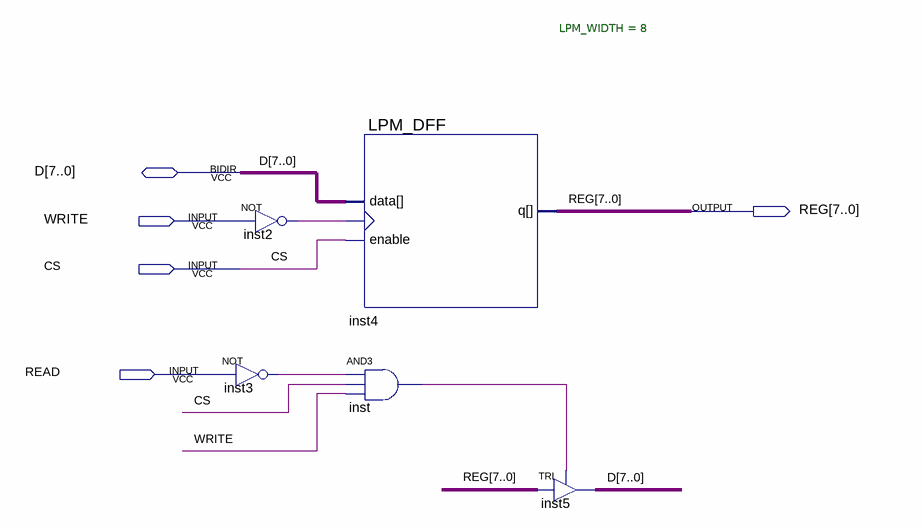
[diagram p0: schematic sheet]
// Quartus schematic IO_REGISTER.bdf as structural Verilog: 5 symbols, 5 pins
module IO_REGISTER (
  input  WRITE,
  input  CS,
  input  READ,
  inout  [7:0] D,
  output [7:0] REG
);

  wire inst2_out, inst3_out, inst_out;

  not inst2 (inst2_out, WRITE);
  not inst3 (inst3_out, READ);
  LPM_DFF #(.LPM_WIDTH(8)) inst4 (.clock(inst2_out), .data(D), .enable(CS), .q(REG));
  and inst (inst_out, inst3_out, CS, WRITE);
  TRI inst5[7:0] (.IN(REG), .OE(inst_out), .OUT(D));
endmodule
